# EAGLE design YOTSUBA_GNSS-receiver_Orion_ver.1.5.3 (EAGLE 9.6.2)
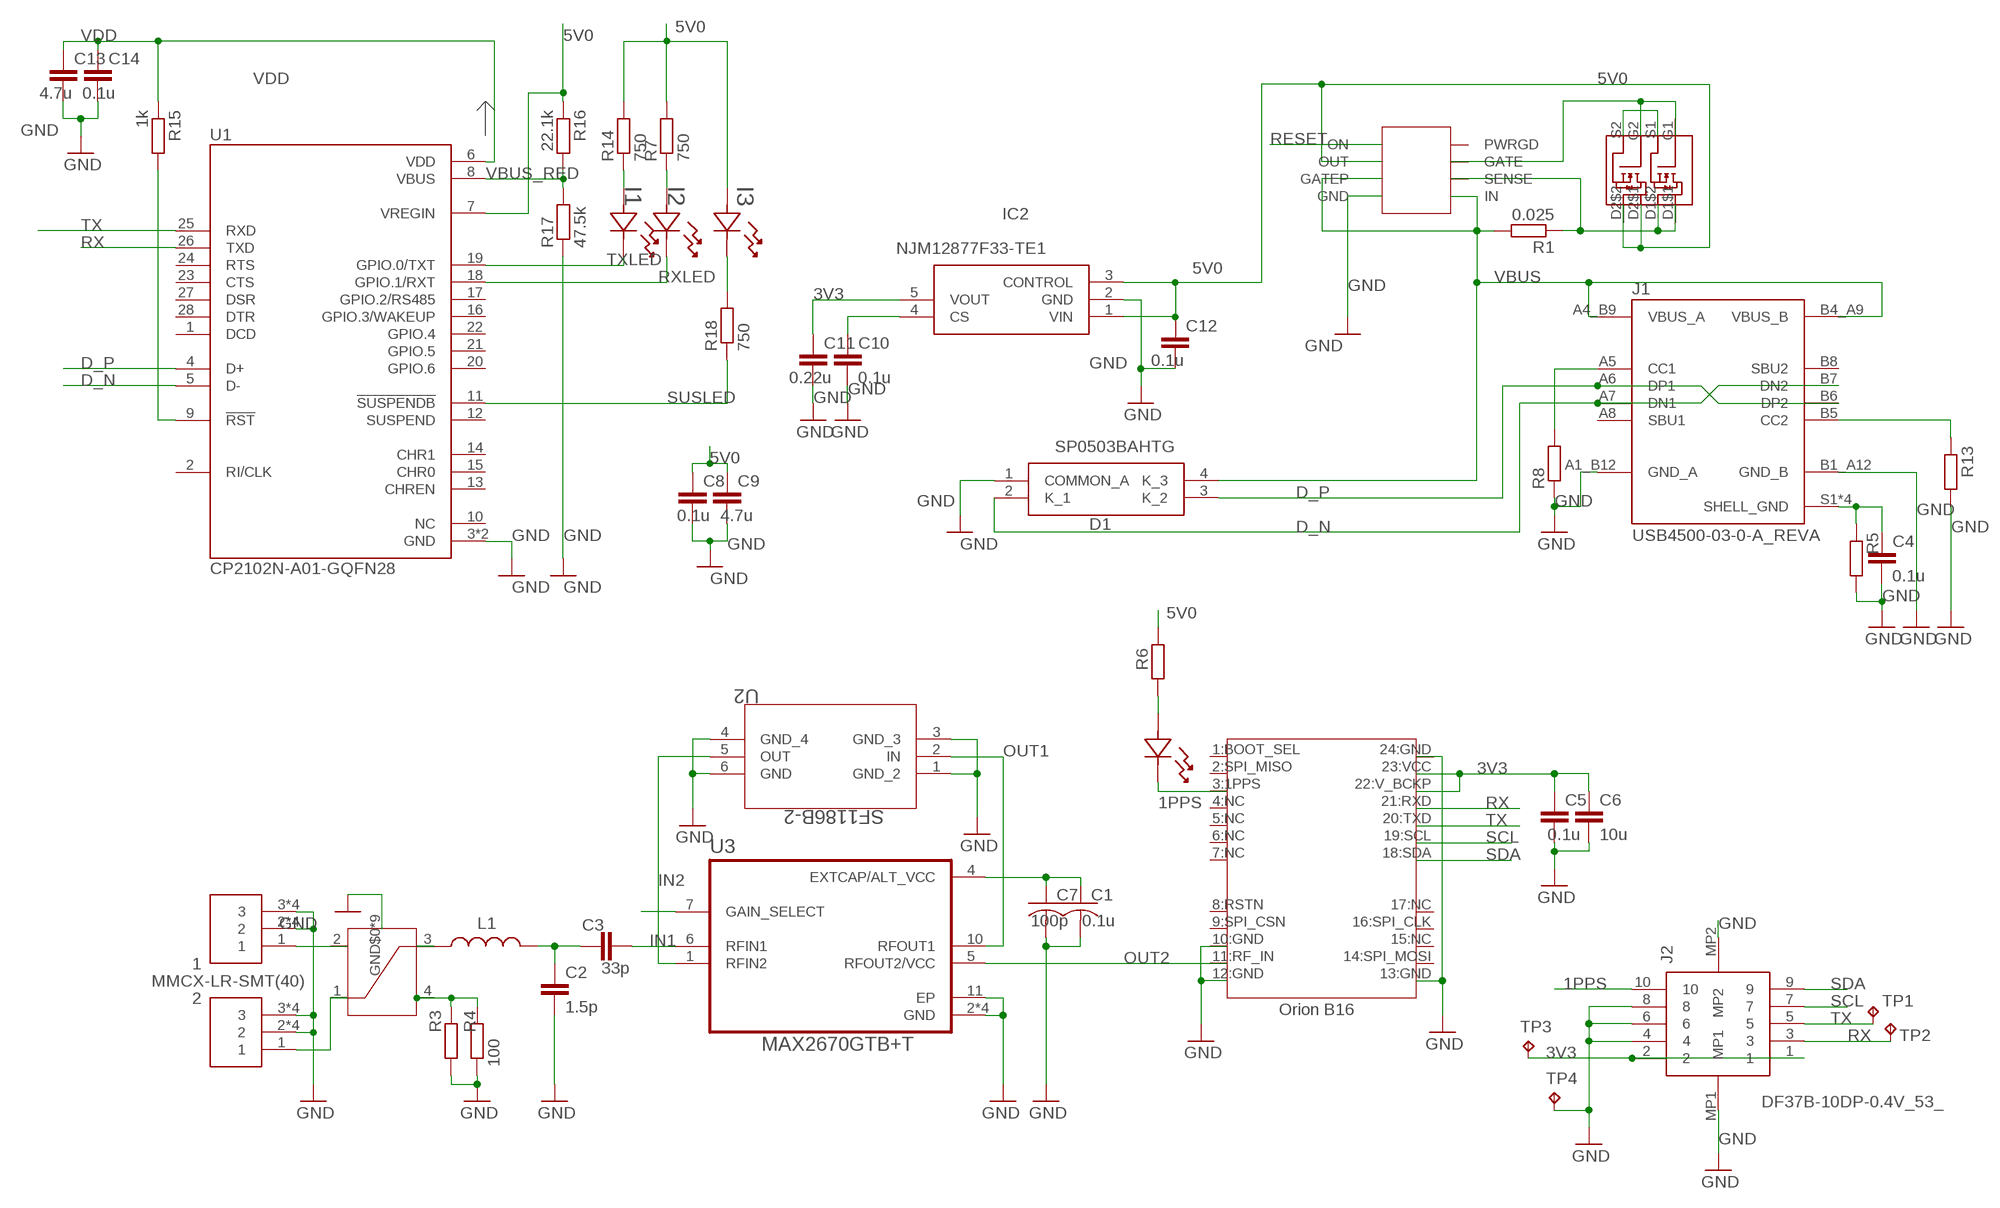
[diagram p0: schematic, sheet 1]

## Parts
1  MMCX-LR-SMT(40)  [MMCX-LR-SMT(40)]
2  MMCX-LR-SMT(40)  [MMCX-LR-SMT(40)]
C1  0.1u  C-US  [C1608_OS]
C2  1.5p  C-EUC1608  [C1608]
C3  33p  C-EUC1608  [C1608]
C4  0.1u  C-EUC1608  [C1608]
C5  0.1u  C-EUC1608  [C1608]
C6  10u  C-EUC1608  [C1608]
C7  100p  C-US  [C1608_OS]
C8  0.1u  C-EUC1608  [C1608]
C9  4.7u  C-EUC1608  [C1608]
C10  0.1u  C-EUC1608  [C1608]
C11  0.22u  C-EUC1608  [C1608]
C12  0.1u  C-EUC1608  [C1608]
C13  4.7u  C-EUC1608  [C1608]
C14  0.1u  C-EUC1608  [C1608]
D1  SP0503BAHTG  [SP0503BAHTG]
I1  SML-E12P8WT86  [LED_SMLD12_ROM]
I2  SML-E12P8WT86  [LED_SMLD12_ROM]
I3  SML-E12P8WT86  [LED_SMLD12_ROM]
IC2  NJM12877F33-TE1  [SOT95P280X120-5N]
J1  USB4500-03-0-A_REVA  [GCT_USB4500-03-0-A_REVA]
J2  DF37B-10DP-0.4V_53_  [DF37B10DP04V53]
L1  4.3n  LQW18AN4N3C00D  [INDC1608X100N]
R1  0.025  R-EU_R0603  [R0603]
R3  100  R-EU_R0603  [R0603]
R4  100  R-EU_R0603  [R0603]
R5  R-EU_R0603  [R0603]
R6  R-EU_R0603  [R0603]
R7  750  R-EU_R0603  [R0603]
R8  R-EU_R0603  [R0603]
R10  SML-E12P8WT86  [LED_SMLD12_ROM]
R13  R-EU_R0603  [R0603]
R14  750  R-EU_R0603  [R0603]
R15  1k  R-EU_R0603  [R0603]
R16  22.1k  R-EU_R0603  [R0603]
R17  47.5k  R-EU_R0603  [R0603]
R18  750  R-EU_R0603  [R0603]
TP1  TPTP13SQ  [TP13SQ]
TP2  TPTP13SQ  [TP13SQ]
TP3  TPTP13SQ  [TP13SQ]
TP4  TPTP13SQ  [TP13SQ]
U1  CP2102N-A01-GQFN28  [QFN50P500X500X80-29N]
U2  SF1186B-2  [SM3030_MUR]
U3  MAX2670GTB+T  [DFN300X300X80-11N]
U$1  ORION_B16  [ORION_B16]
U$3  HC125.A  [HC125.A]
U$7  DMG6898LSD  [SOIC127P600X150-8N]
U$8  LTC4361  [SOP65P280X100-8N]

## Nets
1PPS: J2.10 R10.1 U$1.3:1PPS
3V3 [POWER]: C5.1 C6.1 C11.1 IC2.5(VOUT) J2.1 J2.2 TP3.TP U$1.22:V_BCKP U$1.23:VCC
5V0 [POWER]: C8.1 C9.1 C12.1 I3.2 IC2.1(VIN) IC2.3(CONTROL) R6.2 R7.2 R14.2 R16.1 U1.7(VREGIN) U$7.D2$1 U$7.D2$2 U$8.OUT
$11 [POWER]: C1.1 C7.1 U3.4(EXTCAP/ALT_VCC)
D_N [USB]: D1.2(K_1) J1.A7(DN1) J1.B7(DN2) U1.5(D-)
D_P [USB]: D1.3(K_2) J1.A6(DP1) J1.B6(DP2) U1.4(D+)
GND [gnd]: 1.2 1.3 1.4 1.5 1.P$1 1.P$2 1.P$3 1.P$4 2.2 2.3 2.4 2.5 2.P$1 2.P$2 2.P$3 2.P$4 C1.2 C2.2 C4.2 C5.2 C6.2 C7.2 C8.2 C9.2 C10.2 C11.2 C12.2 C13.2 C14.2 D1.1(COMMON_A) IC2.2(GND) J1.A1_B12(GND_A) J1.B1_A12(GND_B) J2.4 J2.6 J2.8 J2.MP1 J2.MP2 R3.1 R4.1 R5.2 R8.1 R13.2 R17.1 TP4.TP U1.3(GND) U1.29(GND) U2.1(GND_2) U2.3(GND_3) U2.4(GND_4) U2.6(GND) U3.2(GND) U3.3(GND) U3.8(GND) U3.9(GND) U3.11(EP) U$1.10:GND U$1.12:GND U$1.13:GND U$1.24:GND U$3.GND$0(GND) U$3.GND$1(GND) U$3.GND$2(GND) U$3.GND$3(GND) U$3.GND$4(GND) U$3.GND$5(GND) U$3.GND$6(GND) U$3.GND$7(GND) U$3.GND$8(GND) U$8.GND
IN1: C3.2 U3.6(RFIN1)
IN1_2: C2.1 C3.1 L1.2
IN1_3: L1.1 U$3.3
IN2: U2.5(OUT) U3.1(RFIN2)
N$1 [1.1mm]: 1.1 U$3.2
N$2 [1.1mm]: 2.1 U$3.1
N$3: I3.1 R18.2
N$4: C10.1 IC2.4(CS)
N$5: I2.2 R7.1
N$8: U3.7(GAIN_SELECT)
N$9: C4.1 J1.S1(SHELL_GND) J1.S2(SHELL_GND) J1.S3(SHELL_GND) J1.S4(SHELL_GND) R5.1
N$13: I1.2 R14.1
N$14 [gnd]: R3.2 R4.2 U$3.4
N$15: R6.1 R10.2
N$19: U$7.S1 U$7.S2
N$20: R1.1 U$7.D1$1 U$7.D1$2 U$8.SENSE
N$21: J1.B5(CC2) R13.1
N$22: U$7.G1 U$7.G2 U$8.GATE
N$23: J1.A5(CC1) R8.2
N$27: R15.2 U1.9(!RST)
OUT1: U2.2(IN) U3.10(RFOUT1)
OUT2 [50Ω]: U3.5(RFOUT2/VCC) U$1.11:RF_IN
RESET [gnd]: U$8.ON
RX: J2.3 TP2.TP U1.26(TXD) U$1.21:RXD
RXLED: I2.1 U1.18(GPIO.1/RXT)
SCL: J2.7 U$1.19:SCL
SDA: J2.9 U$1.18:SDA
SUSLED: R18.1 U1.11(!SUSPENDB)
TX: J2.5 TP1.TP U1.25(RXD) U$1.20:TXD
TXLED: I1.1 U1.19(GPIO.0/TXT)
VBUS: D1.4(K_3) J1.A4_B9(VBUS_A) J1.B4_A9(VBUS_B) R1.2 U$8.GATEP U$8.IN
VBUS_RED: R16.2 R17.2 U1.8(VBUS)
VDD: C13.1 C14.1 R15.1 U1.6(VDD)
Unconnected: J1.A8(SBU1) J1.B8(SBU2) U1.1(DCD) U1.2(RI/CLK) U1.10(NC) U1.12(SUSPEND) U1.13(CHREN) U1.14(CHR1) U1.15(CHR0) U1.16(GPIO.3/WAKEUP) U1.17(GPIO.2/RS485) U1.20(GPIO.6) U1.21(GPIO.5) U1.22(GPIO.4) U1.23(CTS) U1.24(RTS) U1.27(DSR) U1.28(DTR) U$1.1:BOOT_SEL U$1.2:SPI_MISO U$1.4:NC U$1.5:NC U$1.6:NC U$1.7:NC U$1.8:RSTN U$1.9:SPI_CSN U$1.14:SPI_MOSI U$1.15:NC U$1.16:SPI_CLK U$1.17:NC U$8.PWRGD

## Notes on the sheet
- Orion B16

## Library data of the parts
1 2 = MMCX-LR-SMT(40):MMCX-LR-SMT(40)
C1 C7 = rcl:C-US: CAPACITOR, American symbol
C2-C6 C8-C14 = rcl:C-EU: CAPACITOR, European symbol; SPICEPREFIX: C
D1 = SamacSys_Parts:SP0503BAHTG: ESD Suppressors / TVS Diodes TVS AVAL DIODE SMT Source: Datasheet <https://nl.mouser.com/datasheet/2/240/Littelfuse_TVS_Diode_Array_SP05_Datasheet.pdf-777043.pdf>; ARROW_PART_NUMBER: SP0503BAHTG; ARROW_PRICE-STOCK: https://www.arrow.com/en/products/sp0503bahtg/littelfuse?region=europe; DESCRIPTION: ESD Suppressors / TVS Diodes TVS AVAL DIODE SMT; HEIGHT: 1.22mm; MANUFACTURER_NAME: LITTELFUSE; MANUFACTURER_PART_NUMBER: SP0503BAHTG; MOUSER_PART_NUMBER: 576-SP0503BAHTG; MOUSER_PRICE-STOCK: https://www.mouser.co.uk/ProductDetail/Littelfuse/SP0503BAHTG?qs=uD%2FdkN7XIa0NTYXwHdELYA%3D%3D
I1-I3 R10 = LED_1608_2:SML-E12P8WT86; COPYRIGHT: Copyright (C) 2023 Ultra Librarian. All rights reserved.; DIGI-KEY_PART_NUMBER_1: 511-1585-1-ND; DIGI-KEY_PART_NUMBER_2: 511-1585-2-ND; DIGI-KEY_PART_NUMBER_3: 511-1585-6-ND; MANUFACTURER_PART_NUMBER: SML-E12P8WT86; MFR_NAME: ROHM Semiconductor
IC2 = SamacSys_Parts:NJM12877F33-TE1: LDO Voltage Regulators LDO ADJ High Ripple 3.3V Vo 1% 200mA Source: Datasheet <https://datasheet.datasheetarchive.com/originals/distributors/Datasheets_SAMA/e828f6bebe4b9138c37698b69374413c.pdf>; DESCRIPTION: LDO Voltage Regulators LDO ADJ High Ripple 3.3V Vo 1% 200mA; HEIGHT: 1.2mm; MANUFACTURER_NAME: New Japan Radio; MANUFACTURER_PART_NUMBER: NJM12877F33-TE1; MOUSER_PART_NUMBER: 513-NJM12877F33-TE1; MOUSER_PRICE-STOCK: https://www.mouser.com/Search/Refine.aspx?Keyword=513-NJM12877F33-TE1
J1 = USB4500-03-0-A_REVA:USB4500-03-0-A_REVA; DESCRIPTION: USB-C (USB TYPE-C) USB 2.0 Receptacle Connector 24 (16+8 Dummy) Position Board Edge, Cutout; Surface Mount; Through Hole, Right Angle; DIGI-KEY_PART_NUMBER: 2073-USB4500-03-0-ATR-ND; MF: Global Connector Technology; MP: USB4500-03-0-A; PACKAGE: None; PURCHASE-URL: https://pricing.snapeda.com/search/part/USB4500-03-0-A/?ref=eda
J2 = DF37B-10DP-0.4V_53_:DF37B-10DP-0.4V_53_: Board to Board & Mezzanine Connectors 0.4MM 10P HEADER VERT SMT M-FITTING Source: Datasheet <https://www.arrow.com/en/products/df37b-10dp-0.4v-53/hirose-electric>; DESCRIPTION: Board to Board & Mezzanine Connectors 0.4MM 10P HEADER VERT SMT M-FITTING; HEIGHT: 0.76mm; MANUFACTURER_NAME: Hirose; MANUFACTURER_PART_NUMBER: DF37B-10DP-0.4V(53); MOUSER_PART_NUMBER: 798-DF37B10DP04V53; MOUSER_PRICE-STOCK: https://www.mouser.co.uk/ProductDetail/Hirose-Connector/DF37B-10DP-0.4V53?qs=eDUdFcBPps0qYYvduP3T2g%3D%3D
L1 = LQW18AN4N3C00D:LQW18AN4N3C00D: 2.3 NH +/-.1NH; DESCRIPTION: Inductor with Inductance: 4.3nH Tol. +/-0.2nH, Package: 0603 (1608); DIGIKEY_PART_NUMBER: 490-6896-2-ND; MF: Murata; MP: LQW18AN4N3C00D; PACKAGE: 1608 Murata; PURCHASE-URL: https://pricing.snapeda.com/search?q=LQW18AN4N3C00D&ref=eda
R1 R3-R8 R13-R18 = rcl:R-EU_: RESISTOR, European symbol; SPICEPREFIX: R
TP1-TP4 = testpad:TP: Test pad
U1 = CP2102N-A01-GQFN28:CP2102N-A01-GQFN28: USB Bridge, USB to UART USB 2.0 UART Interface 28-QFN (5x5) Check availability <https://pricing.snapeda.com/parts/CP2102N-A01-GQFN28/Silicon%20Labs/view-part?ref=eda>; AVAILABILITY: In Stock; DESCRIPTION: USB Bridge, USB to UART USB 2.0 UART Interface 28-QFN (5x5); MF: Silicon Labs; MP: CP2102N-A01-GQFN28; PACKAGE: QFN-28 Silicon Labs; PRICE: None; PURCHASE-URL: https://pricing.snapeda.com/search/part/CP2102N-A01-GQFN28/?ref=eda
U2 = SF1186B-2:SF1186B-2; COPYRIGHT: Copyright (C) 2023 Ultra Librarian. All rights reserved.; MANUFACTURER_PART_NUMBER: SF1186B-2; MFR_NAME: Murata
U3 = MAX2670GTB_T:MAX2670GTB+T: None Check availability <https://pricing.snapeda.com/parts/MAX2670GTB%2BT/Analog%20Devices/view-part?ref=eda>; AVAILABILITY: In Stock; DESCRIPTION: GPS/GNSS Front-End Amplifier; MF: Analog Devices; MP: MAX2670GTB+T; PACKAGE: None; PRICE: None; PURCHASE-URL: https://pricing.snapeda.com/search/part/MAX2670GTB+T/?ref=eda
U$1 = Orion_B16:ORION_B16
U$3 = HC125.A:HC125.A
U$7 = DMG6898LSD:DMG6898LSD
U$8 = ltc4361:LTC4361

## Net classes
0 default: clearance 0.121 mm
2 gnd: clearance 0.222 mm to class 1, clearance 0.254 mm
3 POWER: width 0.178 mm, clearance 0.025 mm
4 1.1mm: clearance 0.247 mm to class 1
5 USB: clearance 0.3 mm to class 1, clearance 0.11 mm

## Board
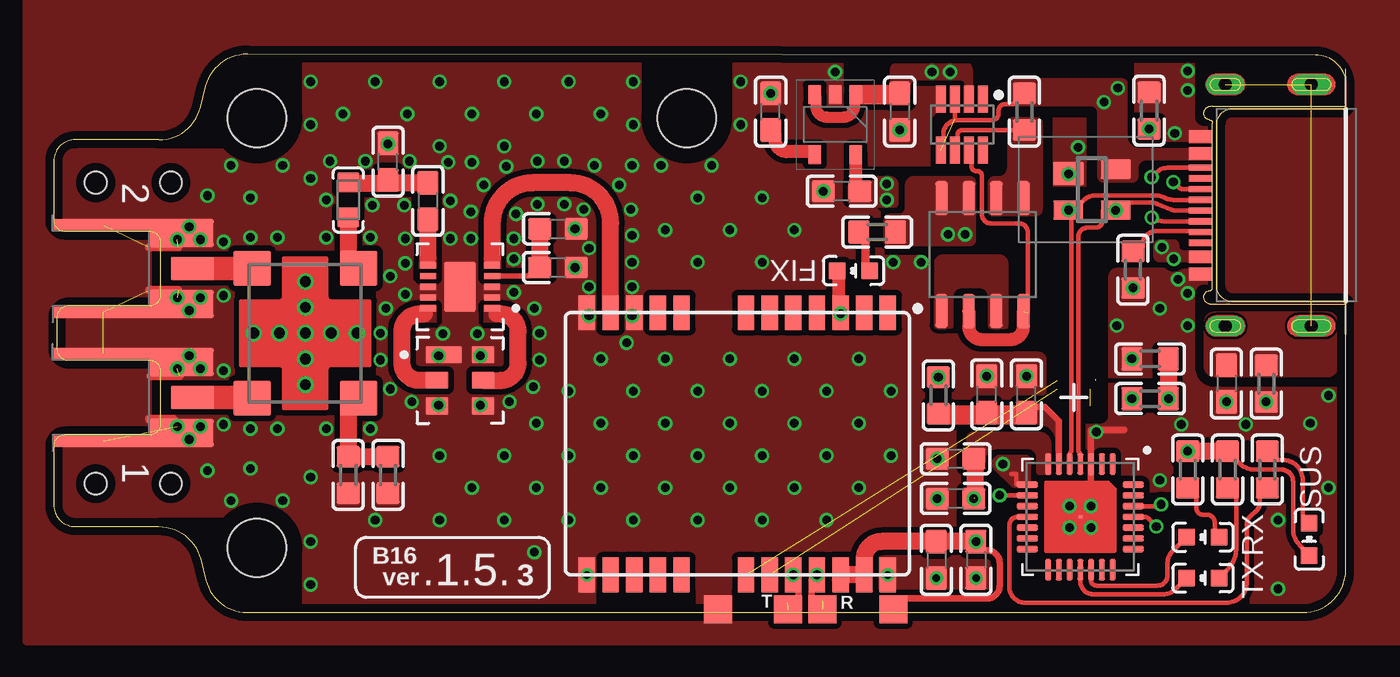
[diagram p1: board, top side]
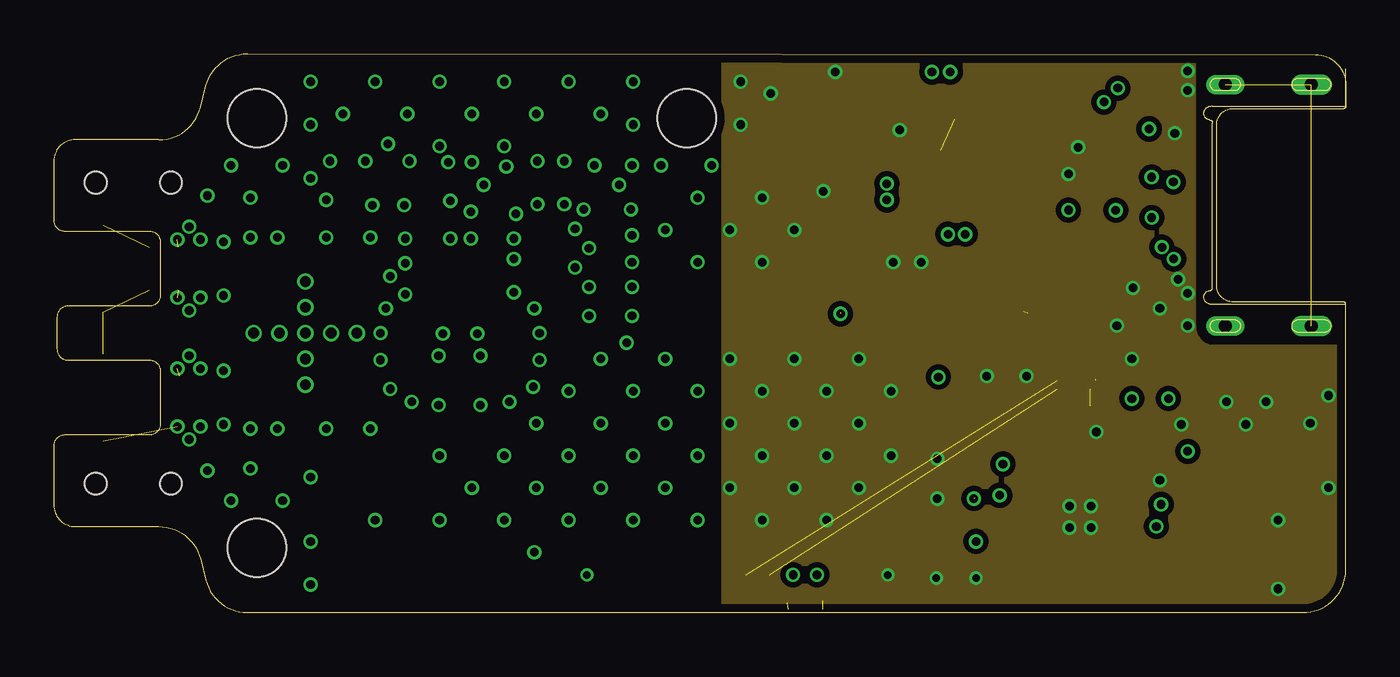
[diagram p2: board, inner layer Route2]
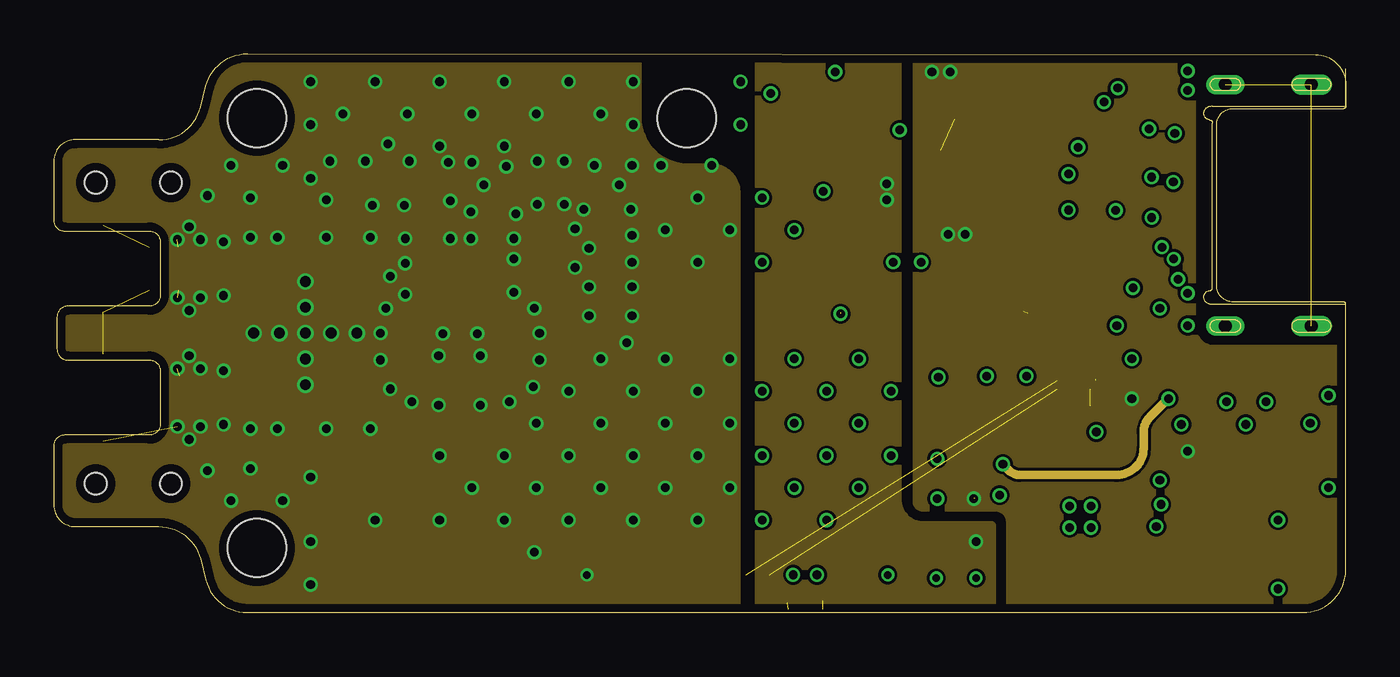
[diagram p3: board, inner layer Route15]
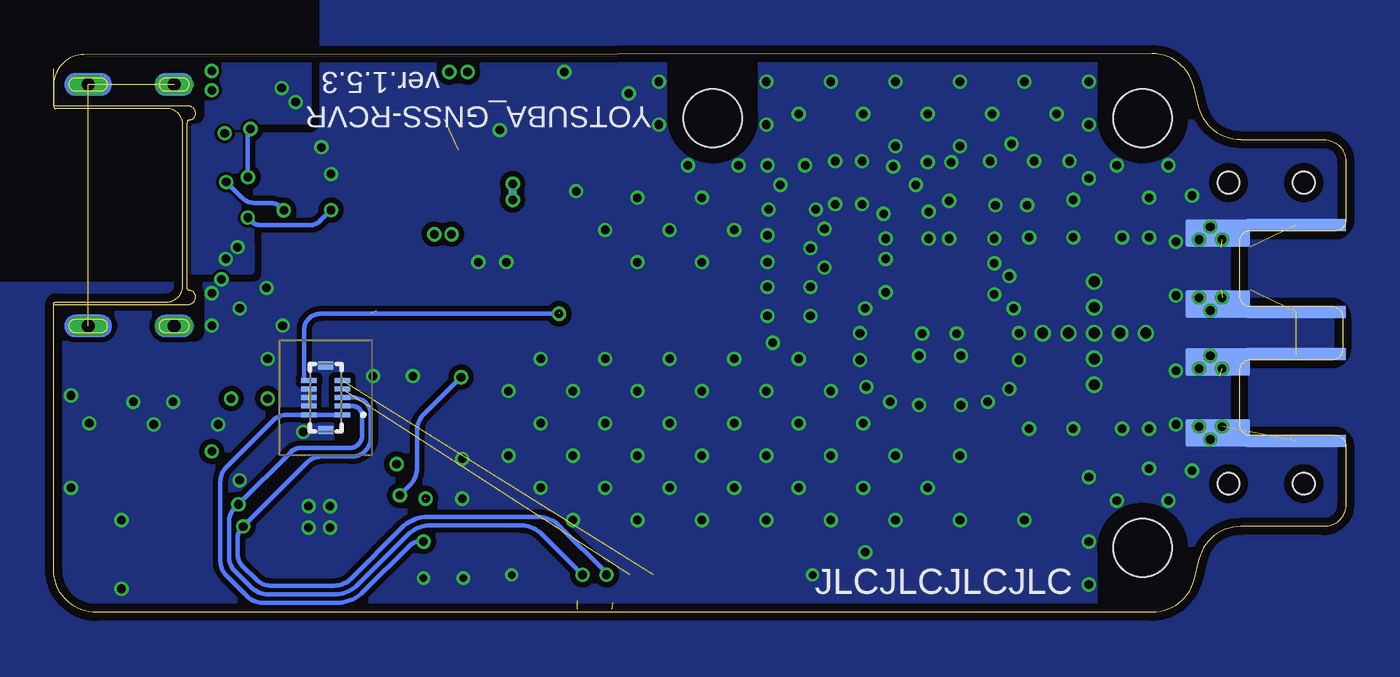
[diagram p4: board, bottom side, seen from below]

Size 60.1 x 26 mm. Coordinates in mm from the lower left corner, seen from the top.
Outline: 0,7.75 0,5 arc90 1,4 4.89,4 arc-76 6.83,2.48 7.07,1.51 arc76 9.01,0 58.1,0 arc90 60.1,1.95 60.1,14.35 arc90 60,14.45 54.85,14.45 arc-90 54.1,15.2 54.1,22.7 arc-90 54.85,23.45 60,23.45 arc90 60.1,23.55 60.1,24.55 arc90 58.7,25.95 9.01,26 arc76 7.07,24.48 6.83,23.52 arc-76 4.89,22 1,22 arc90 0,21 0,18.25 arc90 0.5,17.75 4.45,17.75 arc-90 4.95,17.25 4.95,14.75 arc-90 4.45,14.25 0.65,14.25 arc90 0.15,13.75 0.15,12.25 arc90 0.65,11.75 4.45,11.75 arc-90 4.95,11.25 4.95,8.75 arc-90 4.45,8.25 0.5,8.25 arc90 0,7.75
Copper layers (1+2*15+16): Top 0.035mm / dielectric 1.2mm / Route2 0.035mm / dielectric 0.15mm / Route15 0.035mm / dielectric 0.2mm / Bottom 0.035mm
Design rules "default *": minimum track width 6mil, minimum drill 0.35mm, track to track 5mil, track to pad 0.2mm, pad to pad 5mil, via to via 0.5mm, smd to smd 5mil, copper to edge 0.4mm, drill to drill 6mil, minimum pad ring 0.13mm, minimum via ring 0.13mm, stop-mask expansion 0.015mm, vias tented up to drill 10mil, thermal gap 10mil
Holes 1 mm at 1.95,6 5.45,6 1.95,20 5.45,20
Holes 2.7 mm at 9.45,3 9.45,23 29.45,23
tRestrict: area 27.4,21 to 31.4,25; area 7.5,21 to 11.4,25; area 7.5,1 to 11.4,5; 69 lines
bRestrict: area 27.4,21 to 31.4,25; area 7.5,21 to 11.4,25; area 7.5,1 to 11.4,5; 19 lines

### Footprints (pad centres in the part's own frame; a part is rotated, then mirrored left to right if it is on the bottom)
MMCX-LR-SMT(40) = smd 1.1 x 2: 1 0,-2 | smd 1.3 x 3: 2 1.65,-1.5; 3 -1.65,-1.5 | smd 1.3 x 3 bottom: 4 -1.65,-1.5; 5 1.65,-1.5 | smd 0.55 x 4.6: P$1 -2.025,2.15; P$2 2.025,2.15 | smd 0.55 x 4.6 bottom: P$3 -2.025,2.15; P$4 2.025,2.15
C1608_OS = smd 1.1 x 1: 1 -0.85,0; 2 0.85,0
C1608 = smd 1.1 x 1: 1 -0.85,0; 2 0.85,0
SP0503BAHTG = smd 1.1 x 1.4: 1 -0.75,-1.1 | smd 0.9 x 1.4: 2 0.95,-1.1; 3 0.95,1.1; 4 -0.95,1.1
LED_SMLD12_ROM = smd 0.8 x 0.8: 1 -0.75,0; 2 0.75,0
SOT95P280X120-5N = smd 0.9 x 0.6: 1 -1.4,0.95; 2 -1.4,0; 3 -1.4,-0.95; 4 1.4,-0.95; 5 1.4,0.95
GCT_USB4500-03-0-A_REVA = smd 0.6 x 1.1: A1_B12 -3.2,5.15; A4_B9 -2.4,5.15; B1_A12 3.2,5.15; B4_A9 2.4,5.15 | smd 0.3 x 1.1: A5 -1.25,5.15; A6 -0.25,5.15; A7 0.25,5.15; A8 1.25,5.15; B5 1.75,5.15; B6 0.75,5.15; B7 -0.75,5.15; B8 -1.75,5.15 | drill 0.6 pad 0.95 long: S1 -5.62,0; S4 5.62,0 | drill 0.6 pad 0.8 long: S2 5.62,4; S3 -5.62,4
DF37B10DP04V53 = smd 0.23 x 0.73: 1 -0.8,-0.775; 2 -0.8,0.775; 3 -0.4,-0.775; 4 -0.4,0.775; 5 0,-0.775; 6 0,0.775; 7 0.4,-0.775; 8 0.4,0.775; 9 0.8,-0.775; 10 0.8,0.775 | smd 0.38 x 0.68: MP1 -1.5,0; MP2 1.5,0
INDC1608X100N = smd 0.89 x 1.02: 1 -0.814,0; 2 0.814,0
R0603 = smd 1 x 1.1: 1 -0.85,0; 2 0.85,0
TP13SQ = smd 1.3 x 1.3: TP 0,0
QFN50P500X500X80-29N = smd 1.01 x 0.3: 1 -2.46,1.5; 2 -2.46,1; 3 -2.46,0.5; 4 -2.46,0; 5 -2.46,-0.5; 6 -2.46,-1; 7 -2.46,-1.5; 15 2.46,-1.5; 16 2.46,-1; 17 2.46,-0.5; 18 2.46,0; 19 2.46,0.5; 20 2.46,1; 21 2.46,1.5 | smd 0.3 x 1.01: 8 -1.5,-2.46; 9 -1,-2.46; 10 -0.5,-2.46; 11 0,-2.46; 12 0.5,-2.46; 13 1,-2.46; 14 1.5,-2.46; 22 1.5,2.46; 23 1,2.46; 24 0.5,2.46; 25 0,2.46; 26 -0.5,2.46; 27 -1,2.46; 28 -1.5,2.46 | smd 0.127 x 0.127: 29 0,0
SM3030_MUR = smd 1.7 x 0.81: 1 -0.75,1.19 | smd 1.05 x 0.81: 2 -1.075,0; 3 -1.075,-1.19; 4 1.075,-1.19; 5 1.075,0; 6 1.075,1.19
DFN300X300X80-11N = smd 0.76 x 0.27: 1 -1.485,1; 2 -1.485,0.5; 3 -1.485,0; 4 -1.485,-0.5; 5 -1.485,-1; 6 1.485,-1; 7 1.485,-0.5; 8 1.485,0; 9 1.485,0.5; 10 1.485,1 | smd 1.5 x 2.3: 11 0,0
ORION_B16 = smd 1.6 x 0.8: 1:BOOT_SEL 12.2,1; 2:SPI_MISO 12.2,2.1; 3:1PPS 12.2,3.2; 4:NC 12.2,4.3; 5:NC 12.2,5.4; 6:NC 12.2,6.5; 7:NC 12.2,7.6; 8:RSTN 12.2,10.6; 9:SPI_CSN 12.2,11.7; 10:GND 12.2,12.8; 11:RF_IN 12.2,13.9; 12:GND 12.2,15; 13:GND 0,15; 14:SPI_MOSI 0,13.9; 15:NC 0,12.8; 16:SPI_CLK 0,11.7; 17:NC 0,10.6; 18:SDA 0,7.6; 19:SCL 0,6.5; 20:TXD 0,5.4; 21:RXD 0,4.3; 22:V_BCKP 0,3.2; 23:VCC 0,2.1; 24:GND 0,1
HC125.A = smd 1.625 x 1.75: 1 -3.022,2.475; 2 3.022,2.475; 3 3.022,-2.475; 4 -3.022,-2.475 | drill 0.5: GND$0 0,0; GND$1 0,2.4; GND$2 0,1.2; GND$3 0,-2.4; GND$4 0,-1.2; GND$5 -2.4,0; GND$6 -1.2,0; GND$7 2.4,0; GND$8 1.2,0
SOIC127P600X150-8N = smd 1.58 x 0.589: D1$1 -2.625,1.905; D1$2 -2.625,0.635; D2$1 -2.625,-0.635; D2$2 -2.625,-1.905; G1 2.625,1.905; G2 2.625,-0.635; S1 2.625,0.635; S2 2.625,-1.905
SOP65P280X100-8N = smd 1.237 x 0.459: GATE 1.187,0.325; GATEP -1.187,-0.325; GND -1.187,-0.975; IN 1.187,-0.975; ON -1.187,0.975; OUT -1.187,0.325; PWRGD 1.187,0.975; SENSE 1.187,-0.325

### Placement (x,y rotation side)
1  4.45,16 90 top
2  4.45,10 90 top
C1  23.45,17.85 0 top
C2  15.55,20.98 90 top
C3  17.4,19.15 270 top
C4  54.55,10.65 270 top
C5  42.9,2.45 270 top
C6  41.05,2.45 270 top
C7  23.45,16.05 0 top
C8  41.95,5.3 180 top
C9  41.95,7.15 180 top
C10  33.35,23.3 90 top
C11  36.65,19.6 180 top
C12  39.35,23.3 270 top
C13  43.4,10.15 90 top
C14  45.25,10.15 90 top
D1  48.3,19.68 270 top
I1  53.45,3.5 0 top
I2  53.45,1.6 0 top
I3  58.4,3.4 270 top
IC2  36.35,22.7 270 top
J1  58.5,18.95 90 top
J2  47.45,10 90 bottom
L1  13.7,19.2 90 top
R1  45.15,23.3 90 top
R3  13.7,6.4 90 top
R4  15.55,6.4 90 top
R5  56.4,10.65 270 top
R6  38.3,17.7 0 top
R7  54.6,6.65 90 top
R8  50.2,15.95 90 top
R10  37.2,15.9 0 top
R13  50.95,23.35 90 top
R14  52.75,6.65 90 top
R15  41.15,10.1 90 top
R16  51,9.95 0 top
R17  51,11.8 0 top
R18  56.45,6.65 90 top
TP1  34.15,0.15 0 top
TP2  35.75,0.15 0 top
TP3  39.05,0.15 0 top
TP4  30.9,0.15 0 top
U1  47.75,4.45 270 top
U2  18.9,10.8 0 top
U3  18.9,15.15 180 top
U$1  39.8,1.75 90 top
U$3  11.7,13 90 top
U$7  43.2,16.65 270 top
U$8  42.25,22.7 270 top

### Tracks (layer width: path | path; a pad name or v marks a point on that pad's centre or on a via)
1PPS  (via drill 0.4)  (2 unrouted)
  Top 0.5: v36.6,13.9 36.5,13.9 | 36.5,15.85 R10.1
  Top 0.6: 36.5,15.85 36.5,13.9
  Bottom 0.2: J2.10 48.45,10.8 | v36.6,13.9 47.7,13.9 arc-90 48.45,13.15 48.45,10.87
3V3  (via drill 0.4)
  Top 0.3: 36.35,1.5 U$1.22:V_BCKP | TP3.TP 39.55,0.65 43.4,0.65 arc90 44,1.25 44,2.3 arc90 43.4,2.9 43.3,2.9 C5.1
  Top 0.6: IC2.5 37.3,19.6 C11.1
  Top 0.8: C5.1 C6.1 38.5,3.3 arc90 37.7,2.5 U$1.23:VCC U$1.22:V_BCKP
  Route15 0.2: C5.1 42.95,3.25 43,3.25
  Bottom 0.2: 46.62,9.2 J2.1 J2.2 49.22,9.2 arc-45 49.93,8.91 52.06,6.78 arc-45 52.35,6.07 52.35,2.39 arc-45 52.07,1.72 51.09,0.74 arc-45 50.39,0.45 46.94,0.45 arc-45 45.68,0.97 43.53,3.12 arc45 43.09,3.3 C5.1
  Bottom 0.4: v38.75,19.95 v38.75,19.2
  other vias: 42.9,3.3
  pour Top (no thermals): 38.35,20.3 38.9,20.3 arc-90 39.3,19.9 39.3,19.05 arc-90 39.1,18.85 37.25,18.85 arc-90 36.95,19.15 36.95,19.8 arc-90 37.25,20.1 37.6,20.1 38.03,20.1 arc45 38.24,20.19
  pour Route15 (no thermals): 43.65,-1.4 43.65,4.05 40.45,4.05 arc-90 39.25,5.25 39.25,26.5 arc90 38.9,26.85 32.8,26.85 32.8,-1.4
5V0  (via drill 0.4)  (1 unrouted)
  Top 0.2: R7.2 55.16,6.94 arc45 55.86,6.65 57.1,6.65 arc-90 57.65,6.1 57.65,3.86 arc45 57.94,3.16 58.4,2.7 I3.2
  Top 0.5: C8.1 42.8,5.2 | 37.56,24.1 IC2.1 37.25,24.05 37.25,23.55 arc-90 36.75,23.05 35.95,23.05 arc-90 35.45,23.55 35.45,24.05 IC2.3
  Top 0.8: 42.85,5.3 42.85,7.1 C9.1 | C12.1 39.3,24.1 | R7.2 R14.2
  Top 0.9: 39.3,24.1 37.56,24.1
  Route15 0.4: C8.1 42.8,5.35 42.75,5.35 | R14.2 52.8,7.5
  other vias: 41.7,25.15 40.85,25.15 42.4,17.6 41.6,17.6 50.15,9.95 42.8,5.3 52.75,7.5
  pour Top (no thermals): 46.4,6.4 46.4,7.85 arc90 45.85,8.4 42.75,8.4 arc90 42.45,8.1 42.45,7 43.35,7 43.35,7.1 arc-90 43.85,7.6 45.33,7.6 arc-90 45.7,7.23 45.7,6.55 arc90 45.85,6.4
  pour Top (no thermals): 42.6,17.05 38.85,17.05 arc-90 38.6,17.3 38.6,18.25 arc-90 38.9,18.55 39.3,18.55 arc90 39.6,18.85 39.6,19.9 arc-90 40,20.3 42.6,20.3 arc-90 42.9,20 42.9,17.35 arc-90
  pour Top (no thermals): 37,24.3 arc90 37.1,24.2
  pour Top (no thermals): 38.9,24.15 38.9,25.25 arc-90 39.25,25.6 42.4,25.6 arc-90 42.75,25.25 42.75,24.4 42.8,24.35 42.8,23.65 42.4,23.65 42.4,24.5 arc90 42.12,24.77 40.18,24.77 arc90 39.85,24.45 39.85,24.15
  pour Route15 (no thermals): 40.15,27.45 61.05,27.45 arc-90 61.35,27.15 61.35,25.7 52.95,25.7 52.95,13.3 arc90 54,12.25 60.9,12.25 60.9,11.85 60.8,-0.4 44.5,-0.4 44.5,4.2 arc90 43.8,4.9 40.4,4.9 arc-90 40.15,5.15
$11
  Top 0.25: U3.4 22.01,15.65 arc45 22.16,15.71 22.5,16.05 C7.1
  Top 0.8: C1.1 C7.1
D_N  (via drill 0.4)
  Top 0.2: J1.B7 51.64,18.2 arc-45 51.12,18.42 v51.07,18.37 | 47.45,18.73 47.91,19.18 arc-45 48.43,19.4 51.28,19.4 arc-24 51.61,19.33 51.75,19.27 arc24 52.07,19.2 J1.A7 | U1.5 47.25,7.29 arc-45 47.34,7.5 47.34,18.73 v47.2,18.73 47.43,18.73
  Top 0.25: v47.2,18.73 47.45,18.73
  Bottom 0.2: v51.07,18.37 50.88,18.18 arc-45 50.51,18.02 48.19,18.02 arc-45 47.7,18.23 v47.2,18.73
D_P  (via drill 0.4)
  Top 0.2: J1.A6 52.23,18.7 arc-23 51.92,18.77 51.34,19.01 arc23 51.03,19.07 50.04,19.07 arc45 49.97,19.05 | 49.25,18.73 48.8,18.73 48.8,18.25 arc-90 48.45,17.9 48.06,17.9 arc90 47.66,17.5 47.66,7.5 arc-45 47.75,7.29 U1.4 | J1.B6 52.54,19.7 arc-45 52.33,19.79 v52.08,20.03 | v49.4,18.72 v49.4,18.73
  Top 0.25: 49.97,19.05 49.65,18.73 v49.4,18.73 49.25,18.73 | v52.08,20.03
  Bottom 0.2: v52.08,20.03 51.35,19.3 arc-45 50.77,19.06 50.03,19.06 arc45 49.54,18.86 v49.4,18.72
GND  (via drill 0.35, 0.4)  (13 unrouted)
  Top 0.3: v48.25,4.95 48.15,5.05 48.25,5.05 U1.3 | 48.25,8.5 48.95,8.5 | C14.2 45.3,11 45.45,10.85 | C13.2 43.51,11 43.65,10.86
  Top 0.305: U1.3 48.25,8.5 | 48.95,8.5 49.8,8.5
  Top 0.4: 2.4 5.1,8.35 4.45,9 5.55,9 5.75,8.8 v5.75,8.65 | 5.85,11 4.5,11 | C14.2 45.25,11.3 | 5.8,15 4.45,15 | 5.8,17 4.45,17
  Top 0.6: C8.2 41.1,5.34
  Bottom 0.2: J2.MP2 47.45,11.45 47.6,11.45 47.6,11.5
  other vias: 11.95,24.7 11.95,1.3 11.95,3.3 11.95,22.7 10.65,20.8 8.25,20.8 10.65,5.2 8.25,5.2 5.75,14.65 5.75,11.35 5.75,17.35 7.15,19.4 7.15,6.6 14.95,24.7 17.95,24.7 20.95,24.7 23.95,24.7 26.95,24.7 16.45,23.2 19.45,23.2 25.45,23.2 26.95,22.7 17.95,21.7 31.95,24.7 31.95,22.7 18.45,19.15 6.83,17.35 6.83,14.65 6.83,11.35 6.83,8.65 21.4,16.45 48.25,3.95 47.25,3.95 47.25,4.95 38.95,10.3 38.95,7.3 14.95,4.3 29.95,16.3 28.45,17.8 31.45,17.8 29.95,19.3 30.6,20.8 32.95,19.3 32.95,16.3 39.05,16.3 52.3,15.5 52.75,14.85 52.75,25.2 50.2,15.1 52.45,8.75 55.45,8.75 58.45,8.8 59.3,10.1 50.15,11.8 56.95,4.3 56.95,1.1 59.3,5.8 41.05,1.6 42.9,1.6 38.8,1.75 33.35,24.15 26.9,16.3 22.45,23.2 20.95,21.7 37.45,8.8 37.45,11.8 35.95,10.3 34.45,11.8 34.45,8.8 35.95,7.3 37.45,5.8 35.95,4.3 34.45,5.8 32.95,10.3 31.45,11.8 28.45,11.8 29.95,10.3 31.45,8.8 32.95,7.3 28.45,8.8 29.95,7.3 31.45,5.8 32.95,4.3 29.95,4.3 28.45,5.8 26.95,7.3 26.95,10.3 25.45,11.8 25.45,8.8 25.45,5.8 26.95,4.3 23.95,7.3 23.95,10.3 22.45,8.8 22.45,5.8 20.95,7.3 20.95,4.3 23.95,4.3 22.35,2.8 17.95,4.3 19.45,5.8 17.95,7.3 34.45,17.8 13.45,23.2 15.55,21.8 35.8,19.6 45.25,11 43.4,11 41.1,7.15 41.1,5.3 56.4,9.8 54.55,9.8 51.45,6.15 39.35,22.45 47.65,21.65 47.2,20.4 52.75,13.35 49.45,13.35 11.95,20.2 11.95,6.3 7.9,11.25 7.9,8.75 7.9,14.75 7.9,17.25 26.9,17.55 26.9,15.15 24.9,15.15 24.9,16.95 26.85,18.75 26.3,19.9 25.15,20.8 23.75,21 22.5,21 22.5,19 23.75,19 21.05,20.75 20,19.9 19.4,18.65 19.4,17.4 21.4,17.4 21.5,18.55 24.65,18.75 21.4,14.9 14.82,18.95 16.3,18.95 14.72,17.45 16.35,17.4 12.67,17.45 12.67,19.2 18.45,17.4 16.35,16.25 16.35,14.8 15.65,15.65 22.6,13 22.6,11.75 15.2,13 15.2,11.75 15.45,14.15 22.35,14.15 22.3,10.5 21.2,9.8 15.65,10.4 16.65,9.8 16.55,21 14.5,21 18.35,20.95 12.85,21 17.9,9.65 19.85,9.65 17.9,11.95 19.85,11.95 18.1,12.97 19.7,12.97 9.15,8.55 9.15,17.45 10.4,17.45 10.4,8.55 26.9,13.8 24.9,13.8 26.65,12.55 28.25,20.8 51.45,14.15 12.67,8.55 14.72,8.55 6.3,17.95 6.3,14.05 6.3,11.95 6.3,8.05 52.75,24.3 48.5,8.4 26.9,20.8 19.45,20.95 9.15,6.7 9.15,19.3 52.15,22.3 36.35,25.15 24.25,17.85 24.25,16.05 24.8,1.75 40.35,16.3
  pour Top (no thermals): -1.25,28.95 67.2,28.95 67.2,-1.35 -1.25,-1.35
  pour Top (no thermals): 52.35,21.9 arc-90 52.3,21.95
  pour Bottom (no thermals): 47.55,28.85 47.55,22.75 arc90 48.15,22.15 50.75,22.15 50.75,18.6 50.25,18.1 50.25,15.75 arc90 50.8,15.2 63.95,15.2 63.95,-4.2 -4,-4.2 -4,28.85
  pour Route2 (no thermals): 31.25,28.7 31.25,-1.9 62.8,-1.9 arc90 63.3,-1.4 63.3,12.25 54,12.25 arc-90 52.95,13.3 52.95,27 arc90 51.25,28.7
  pour Route15 (no thermals): 27.15,28.5 27.15,23.05 arc90 29.5,20.7 30.6,20.7 arc-90 31.75,19.55 31.75,0.15 arc-90 30.6,-1 -3.2,-1 arc-90 -3.7,-0.5 -3.7,28.6 arc-90 -3.2,29.1 26.55,29.1 arc-90
IN1
  Top 0.152: U3.6 17.4,16.21 17.4,16.5
  Top 0.8: C3.2 17.4,16.5
  pour Top (no thermals): 17,16.25 17,16.56 17.05,16.56 17.8,16.56 17.8,16.29 17.8,16.01 17.72,16.01 17,16.01
IN1_2
  Top 0.8: L1.2 13.75,19.96 15.55,19.96 C2.1 15.7,19.98 17.15,19.98 17.29,20.11 C3.1
IN1_3
  Top 0.8: L1.1 13.7,16.5 U$3.3
IN2
  Top 0.152: 20.6,13.89 20.38,13.89 U3.1
  Top 0.8: U2.5 20.8,10.8 arc90 21.6,11.6 21.6,13.09 arc90 20.8,13.89 20.6,13.89
  pour Top (no thermals): 20,14.29 20.69,14.29 20.69,13.49 20,13.49
N$1
  Top 1.1: 1.1 9.2,16 U$3.2
N$2
  Top 1.1: U$3.1 9.2,10 2.1
N$3
  Top 0.2: I3.1 58.1,4.45 58.1,6.15 arc90 57.15,7.1 56.85,7.1 R18.2
  Top 0.4: R18.2 56.65,7.7
N$4
  Top 0.6: IC2.4 35.25,21.45 34.1,21.45 arc-90 33.55,22 33.55,22.25 C10.1
N$5
  Top 0.2: R7.1 55,5.8 55,2.94 arc-45 54.62,2.02 I2.2
N$9  (2 unrouted)
  pour Top (no thermals): 54,14 59.25,14 arc-90 59.75,13.5 59.75,11.45 arc-90 59.25,10.95 54,10.95 arc-90 53.5,11.45 53.5,13.5 arc-90
N$13
  Top 0.2: I1.2 54,3.7 54,4.2 arc90 53.65,4.55 53.45,4.55 arc-90 53.15,4.85 53.15,5.55 52.9,5.8 R14.1
N$14
  Top 0.8: U$3.4 13.7,9.54 R3.2 R4.2
N$15
  Top 0.4: R10.2 37.75,15.9 37.75,17.4 R6.1
N$19
  pour Top (no thermals): 43.6,13.2 44.25,13.2 arc90 44.4,13.35 44.4,16.25 arc90 44,16.65 41.35,16.65 arc90 40.95,16.25 40.95,13.35 arc90 41.1,13.2 41.7,13.2 arc90 41.85,13.35 41.85,14.7 arc-90 42.25,15.1 43.05,15.1 arc-90 43.45,14.7 43.45,13.35 arc90
N$20
  Top 0.2: U$8.SENSE 42.03,21.61 42.03,22.2 arc-90 42.28,22.45 R1.1
  Top 0.45: 45.15,22.55 R1.1
  pour Top (no thermals): 43.78,20.3 43.95,20.3 arc90 44.35,20.7 44.35,22.75 arc-90 44.65,23.05 45.7,23.05 arc-90 46,22.75 46,18.75 arc-90 45.7,18.45 43.65,18.45 arc-90 43.45,18.65 43.45,19.98 arc-90
N$21  (via drill 0.4)
  Top 0.2: J1.B5 51.87,20.7 arc45 51.26,20.45 v51.07,20.26
  Bottom 0.2: R13.1 51.07,22.5 v51.07,20.26
  other vias: 50.95,22.5
N$22  (1 unrouted)
  Top 0.2: U$8.GATE 42.68,21.41 42.7,21.41 42.7,20.74 arc90 42.9,20.54 42.95,20.54 arc-90 43.18,20.32 43.18,18.53 arc90 43.6,18.1 44.91,18.1 arc-90 45.3,17.7 45.3,13.93
  Top 0.6: U$7.G2 42.57,13.3 arc90 43.17,12.7 44.51,12.7 arc90 45.11,13.3 U$7.G1
N$23
  Top 0.2: J1.A5 53.3,17.75 51.3,17.75 arc90 50.65,17.1 50.65,17 50.45,16.8
  Top 0.25: R8.2 50.45,16.8
N$27  (via drill 0.4)
  Top 0.2: U1.9 v44,5.45
  Top 0.25: v44,5.45
  Bottom 0.2: R15.2 42.9,9.2 arc-45 43.2,8.47 43.2,6.74 arc45 43.54,5.91 v44,5.45
  other vias: 41.15,10.95
OUT1
  Top 0.152: 17.25,13.89 17.41,13.89 U3.10
  Top 0.8: U2.2 17,10.8 arc-90 16.2,11.6 16.2,13.09 arc-90 17,13.89 17.25,13.89
  pour Top (no thermals): 17.8,14.29 17.8,13.49 17.04,13.49 17.04,14.29
OUT2
  Top 0.152: U3.5 20.38,16.46 20.4,16.48
  Top 0.8: U$1.11:RF_IN 25.9,18.14 arc90 24.05,19.99 22.25,19.99 arc90 20.4,18.14 20.4,16.48
  pour Top (no thermals): 20,16.01 20,16.54 20.8,16.54 20.8,16.01
RX  (via drill 0.4)  (1 unrouted)
  Top 0.2: v51.51,5.03 51.43,4.95 50.11,4.95
  Top 0.3: U1.26 50.11,4.95 | U$1.21:RXD 35.25,1.5 35.25,0.55 35.75,0.55
  Bottom 0.2: 35.55,1.7 U$1.21:RXD 37.4,3.65 arc-45 38.36,4.05 42.58,4.05 arc-45 43.64,3.61 45.96,1.29 arc45 47.02,0.85 50.15,0.85 arc45 50.92,1.17 51.65,1.9 arc45 51.95,2.62 51.95,4.22 arc45 51.69,4.85 v51.51,5.03 49.07,7.47 arc45 48.64,7.65 46.35,7.65 arc-90 45.75,8.25 45.75,9.15 arc-90 46.2,9.6 J2.3
  other vias: 35.5,1.75
RXLED
  Top 0.2: 47.75,2.09 47.75,1.45 arc90 48.35,0.85 51.63,0.85 arc45 52.18,1.08 I2.1
  Top 0.3: U1.18 47.75,2.09
SCL  (1 unrouted)
SDA  (1 unrouted)
SUSLED
  Top 0.2: U1.11 44.85,4.45 arc90 44.45,4.05 44.45,1.2 arc90 45.2,0.45 54.55,0.45 arc90 55.5,1.4 55.5,4.13 arc-45 55.62,4.42 55.98,4.78 arc45 56.1,5.07 56.1,5.45 R18.1
TX  (via drill 0.4)  (1 unrouted)
  Top 0.2: v51.29,4 50.93,4.36 arc45 50.71,4.45 U1.25 | U$1.20:TXD v34.39,1.75
  Top 0.3: 34.4,1.25 U$1.20:TXD 34.65,1.5 34.65,0.45 34.1,0.45
  Bottom 0.2: v34.39,1.75 34.39,1.84 36.57,4.02 arc-45 37.61,4.45 42.68,4.45 arc-45 43.91,3.94 46.3,1.55 arc45 47.03,1.25 50.02,1.25 arc45 50.67,1.52 51.33,2.18 arc45 51.54,2.69 51.54,3.5 arc45 51.36,3.93 v51.29,4 48.3,6.99 arc45 47.67,7.25 46.25,7.25 arc-90 45.35,8.15 45.35,9.2 arc-90 46.15,10 J2.5
TXLED
  Top 0.2: I1.1 52.04,2.84 arc45 51.8,2.26 51.8,1.7 arc-90 51.35,1.25 48.5,1.25 arc-90 48.25,1.5 48.25,2.09
  Top 0.3: U1.19 48.25,2.09
VBUS  (via drill 0.4)  (1 unrouted)
  Top 0.2: U$8.GATEP 41.93,22.95 | 44.88,24.32 44.98,24.32 | R1.2 44.65,23.65 44.25,23.65 arc90 43.95,23.35 43.95,23.2 arc-90 43.65,22.9 42.03,22.9 arc90 41.38,22.25 41.38,22 41.28,22 U$8.IN
  Top 0.45: 44.85,24.45 44.98,24.32 R1.2
  Top 0.5: 49.75,20.57 49.45,20.57 D1.4
  other vias: 51.55,17 52.1,16.45 49.5,24.4 48.85,23.75
  pour Top (no thermals): 53.7,16.3 51.45,16.3 arc-90 51.15,16.6 51.15,17.05 arc-90 51.45,17.35 52.1,17.35 arc-90 52.35,17.1 52.35,17.05 arc90 52.55,16.85 53.7,16.85
  pour Top (no thermals): 48.55,20.3 48.55,23.25 arc90 48.25,23.55 44.35,23.55 44.35,24.55 arc-90 44.65,24.85 49.7,24.85 arc-90 49.95,24.6 49.95,22.15 arc90 50.5,21.6 53.55,21.6 53.55,21.05 50.85,21.05 arc90 50.45,20.65 50.45,20.3 arc-90 50.15,20 48.85,20 arc-90
  pour Bottom (no thermals): 51,15.9 54.7,15.9 54.7,26.4 48.3,26.4 48.3,22.9 51,22.9 50.95,15.9
VBUS_RED  (via drill 0.4)
  Top 0.2: U1.8 44.79,5.95 44.79,6.45 44.55,6.45
  Top 0.3: U1.8 45.35,5.95 | R16.2 51.85,9.97
  Top 0.8: R17.2 R16.2
  Route15 0.4: R16.2 50.99,9.09 arc45 50.7,8.39 50.7,7.65 arc-90 49.45,6.4 44.91,6.4 arc-45 44.46,6.59 v44.15,6.9
  other vias: 51.85,9.95
  pour Top (no thermals): 45.4,5.8 44.72,5.8 arc-45 44.51,5.89 43.78,6.62 arc-45 43.65,6.95 arc-90 44.05,7.35 45.15,7.35 arc-90 45.45,7.05 45.45,5.85 arc-90
VDD
  Top 0.25: C14.1 45.51,9.56
  Top 0.3: C14.1 45.25,9.6 | U1.6 46.75,8.91 46.1,9.56 45.51,9.56
  Top 0.8: C14.1 45.15,9.2 | 43.5,9.2 C13.1
  Top 0.9: 45.15,9.2 43.5,9.2 | R15.1 41.2,9.2 43.3,9.2 C13.1
  pour Top (no thermals): 45.4,9.6 46.05,9.6 46.75,8.9 46.85,8.8 46.85,7.5 46.6,7.5 46.6,7.95 arc90 45.8,8.75 45.45,8.75 45.4,8.8

### Text on the board
tPlace: 2 | FIX | 1 | SUS | RX | B16 | ver | .1.5. | 3 | TX
tNames: T | R
bNames: ver.1.5.3 | YOTSUBA_GNSS-RCVR | JLCJLCJLCJLC